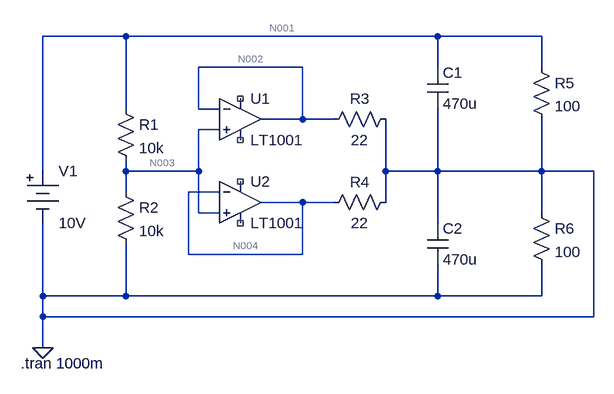
[diagram p0: schematic D-39_1.asc]
D-39_1.asc, the LTspice schematic file:
Version 4
SHEET 1 884 680
WIRE 160 -64 32 -64
WIRE 640 -64 160 -64
WIRE 800 -64 640 -64
WIRE 432 -16 272 -16
WIRE 640 -16 640 -64
WIRE 800 -16 800 -64
WIRE 160 48 160 -64
WIRE 272 48 272 -16
WIRE 304 48 272 48
WIRE 432 64 432 -16
WIRE 432 64 368 64
WIRE 480 64 432 64
WIRE 304 80 272 80
WIRE 32 144 32 -64
WIRE 160 144 160 128
WIRE 272 144 272 80
WIRE 272 144 160 144
WIRE 560 144 560 64
WIRE 640 144 640 48
WIRE 640 144 560 144
WIRE 800 144 800 64
WIRE 800 144 640 144
WIRE 880 144 800 144
WIRE 160 176 160 144
WIRE 304 176 256 176
WIRE 432 192 368 192
WIRE 480 192 432 192
WIRE 560 192 560 144
WIRE 272 208 272 144
WIRE 304 208 272 208
WIRE 800 208 800 144
WIRE 640 224 640 144
WIRE 256 272 256 176
WIRE 432 272 432 192
WIRE 432 272 256 272
WIRE 32 336 32 224
WIRE 160 336 160 256
WIRE 160 336 32 336
WIRE 640 336 640 288
WIRE 640 336 160 336
WIRE 800 336 800 288
WIRE 800 336 640 336
WIRE 32 368 32 336
WIRE 880 368 880 144
WIRE 880 368 32 368
WIRE 32 416 32 368
FLAG 32 416 0
SYMBOL Misc\\battery 32 128 R0
SYMATTR InstName V1
SYMATTR Value 10V
SYMBOL res 144 32 R0
SYMATTR InstName R1
SYMATTR Value 10k
SYMBOL res 144 160 R0
SYMATTR InstName R2
SYMATTR Value 10k
SYMBOL Opamps\\LT1001 336 0 R0
SYMATTR InstName U1
SYMBOL Opamps\\LT1001 336 128 R0
SYMATTR InstName U2
SYMBOL res 464 80 R270
WINDOW 0 32 56 VTop 2
WINDOW 3 0 56 VBottom 2
SYMATTR InstName R3
SYMATTR Value 22
SYMBOL res 464 208 R270
WINDOW 0 32 56 VTop 2
WINDOW 3 0 56 VBottom 2
SYMATTR InstName R4
SYMATTR Value 22
SYMBOL cap 624 -16 R0
SYMATTR InstName C1
SYMATTR Value 470u
SYMBOL cap 624 224 R0
SYMATTR InstName C2
SYMATTR Value 470u
SYMBOL res 784 -32 R0
SYMATTR InstName R5
SYMATTR Value 100
SYMBOL res 784 192 R0
SYMATTR InstName R6
SYMATTR Value 100
TEXT -2 440 Left 2 !.tran 1000m

The netlist it stands for:
* D-39_1.asc
V1 N001 0 10V
R1 N001 N003 10k
R2 N003 0 10k
XU1 N003 N002 NC_01 NC_02 N002 LT1001  ; pins In+ In- V+ V- OUT
XU2 N003 N004 NC_03 NC_04 N004 LT1001  ; pins In+ In- V+ V- OUT
R3 N002 0 22
R4 N004 0 22
C1 N001 0 470u
C2 0 0 470u
R5 N001 0 100
R6 0 0 100
.tran 1000m
.lib LTC.lib
.backanno
.end

* Results of the author's LTspice run, read from the files saved beside the schematic
* Operating Point, zero values left out:
*   V(n001) = 10 V
*   V(n003) = 1.857 V
*   V(n002) = 6.918 mV
*   V(n004) = 6.918 mV
*   I(R5) = 100 mA
*   I(R4) = 314.5 µA
*   I(R3) = 314.5 µA
*   I(R2) = 185.7 µA
*   I(R1) = 814.3 µA
*   I(V1) = -100.8 mA
*   Ix(u1:1) = 314.3 µA
*   Ix(u1:2) = -314.3 µA
*   Ix(u1:5) = -177.9 nA
*   Ix(u2:1) = 314.3 µA
*   Ix(u2:2) = -314.3 µA
*   Ix(u2:5) = -177.9 nA